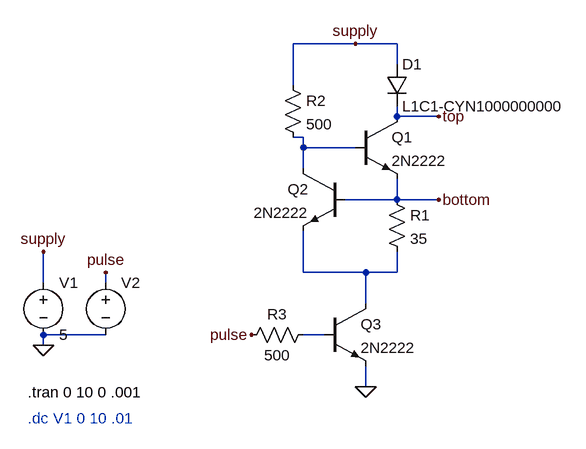
[diagram p0: schematic RED_LED.asc]
RED_LED.asc, the LTspice schematic file:
Version 4.1
SHEET 1 880 680
WIRE 512 -256 416 -256
WIRE 576 -256 512 -256
WIRE 576 -224 576 -256
WIRE 416 -192 416 -256
WIRE 576 -144 576 -160
WIRE 640 -144 576 -144
WIRE 432 -112 416 -112
WIRE 432 -96 432 -112
WIRE 512 -96 432 -96
WIRE 432 -64 432 -96
WIRE 576 -16 576 -48
WIRE 576 -16 496 -16
WIRE 640 -16 576 -16
WIRE 432 96 432 32
WIRE 528 96 432 96
WIRE 576 96 576 64
WIRE 576 96 528 96
WIRE 32 112 32 64
WIRE 128 112 128 96
WIRE 528 144 528 96
WIRE 128 192 32 192
WIRE 464 192 432 192
WIRE 32 208 32 192
WIRE 528 272 528 240
FLAG 32 208 0
FLAG 32 64 supply
FLAG 512 -256 supply
FLAG 640 -144 top
FLAG 640 -16 bottom
FLAG 528 272 0
FLAG 128 96 pulse
FLAG 352 192 pulse
SYMBOL voltage 32 96 R0
WINDOW 123 0 0 Left 0
WINDOW 39 0 0 Left 0
SYMATTR InstName V1
SYMATTR Value 5
SYMBOL npn 512 -144 R0
SYMATTR InstName Q1
SYMATTR Value 2N2222
SYMBOL npn 496 -64 M0
SYMATTR InstName Q2
SYMATTR Value 2N2222
SYMBOL res 560 -32 R0
SYMATTR InstName R1
SYMATTR Value 35
SYMBOL res 400 -208 R0
SYMATTR InstName R2
SYMATTR Value 500
SYMBOL diode 560 -224 R0
SYMATTR InstName D1
SYMATTR Value L1C1-CYN1000000000
SYMBOL npn 464 144 R0
SYMATTR InstName Q3
SYMATTR Value 2N2222
SYMBOL res 448 176 R90
WINDOW 0 0 56 VBottom 2
WINDOW 3 32 56 VTop 2
SYMATTR InstName R3
SYMATTR Value 500
SYMBOL voltage 128 96 R0
WINDOW 3 24 96 Invisible 2
WINDOW 123 0 0 Left 0
WINDOW 39 0 0 Left 0
SYMATTR InstName V2
SYMATTR Value PULSE(0 5 0 .01 .01 .5 1)
TEXT 8 320 Left 2 ;.dc V1 0 10 .01
TEXT 8 280 Left 2 !.tran 0 10 0 .001

The netlist it stands for:
* RED_LED.asc
V1 supply 0 5
Q1 top N001 bottom 0 2N2222
Q2 N001 bottom N002 0 2N2222
R1 bottom N002 35
R2 supply N001 500
D1 supply top L1C1-CYN1000000000
Q3 N002 N003 0 0 2N2222
R3 N003 pulse 500
V2 pulse 0 PULSE(0 5 0 .01 .01 .5 1)
.model D D
.lib standard.dio
.model NPN NPN
.model PNP PNP
.lib standard.bjt
* .dc V1 0 10 .01
.tran 0 10 0 .001
.backanno
.end

* Results of the author's LTspice run, read from the files saved beside the schematic
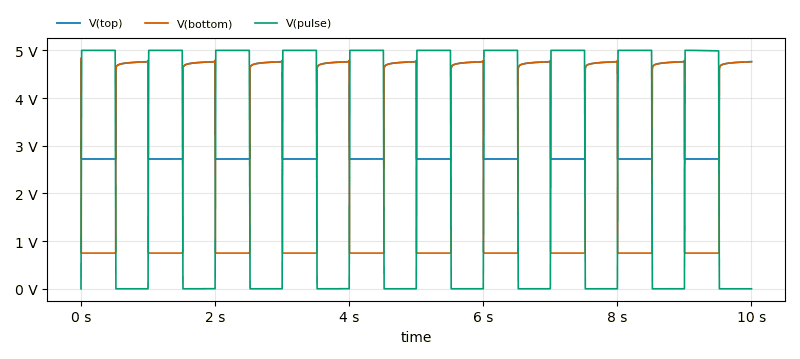
[diagram p1: Transient Analysis of RED_LED.asc, plotted from the saved traces]
* Transient Analysis, 1 run:
*   V(top): min 2.722 V, max 4.817 V, average 3.695 V, rms 3.829 V, last 4.763 V
*   V(bottom): min 748.7 mV, max 4.839 V, average 2.675 V, rms 3.335 V, last 4.762 V
*   V(pulse): min 0 V, max 5 V, average 2.55 V, rms 3.559 V, last 0 V